# EAGLE design Own_Multi.Display.Board.dev_v1.0_Final_AR (EAGLE 9.6.2)
COMPANY: ADAFRUIT INDUSTRIES; DRAWN: KTOWN; REV: A; YEAR: 2019
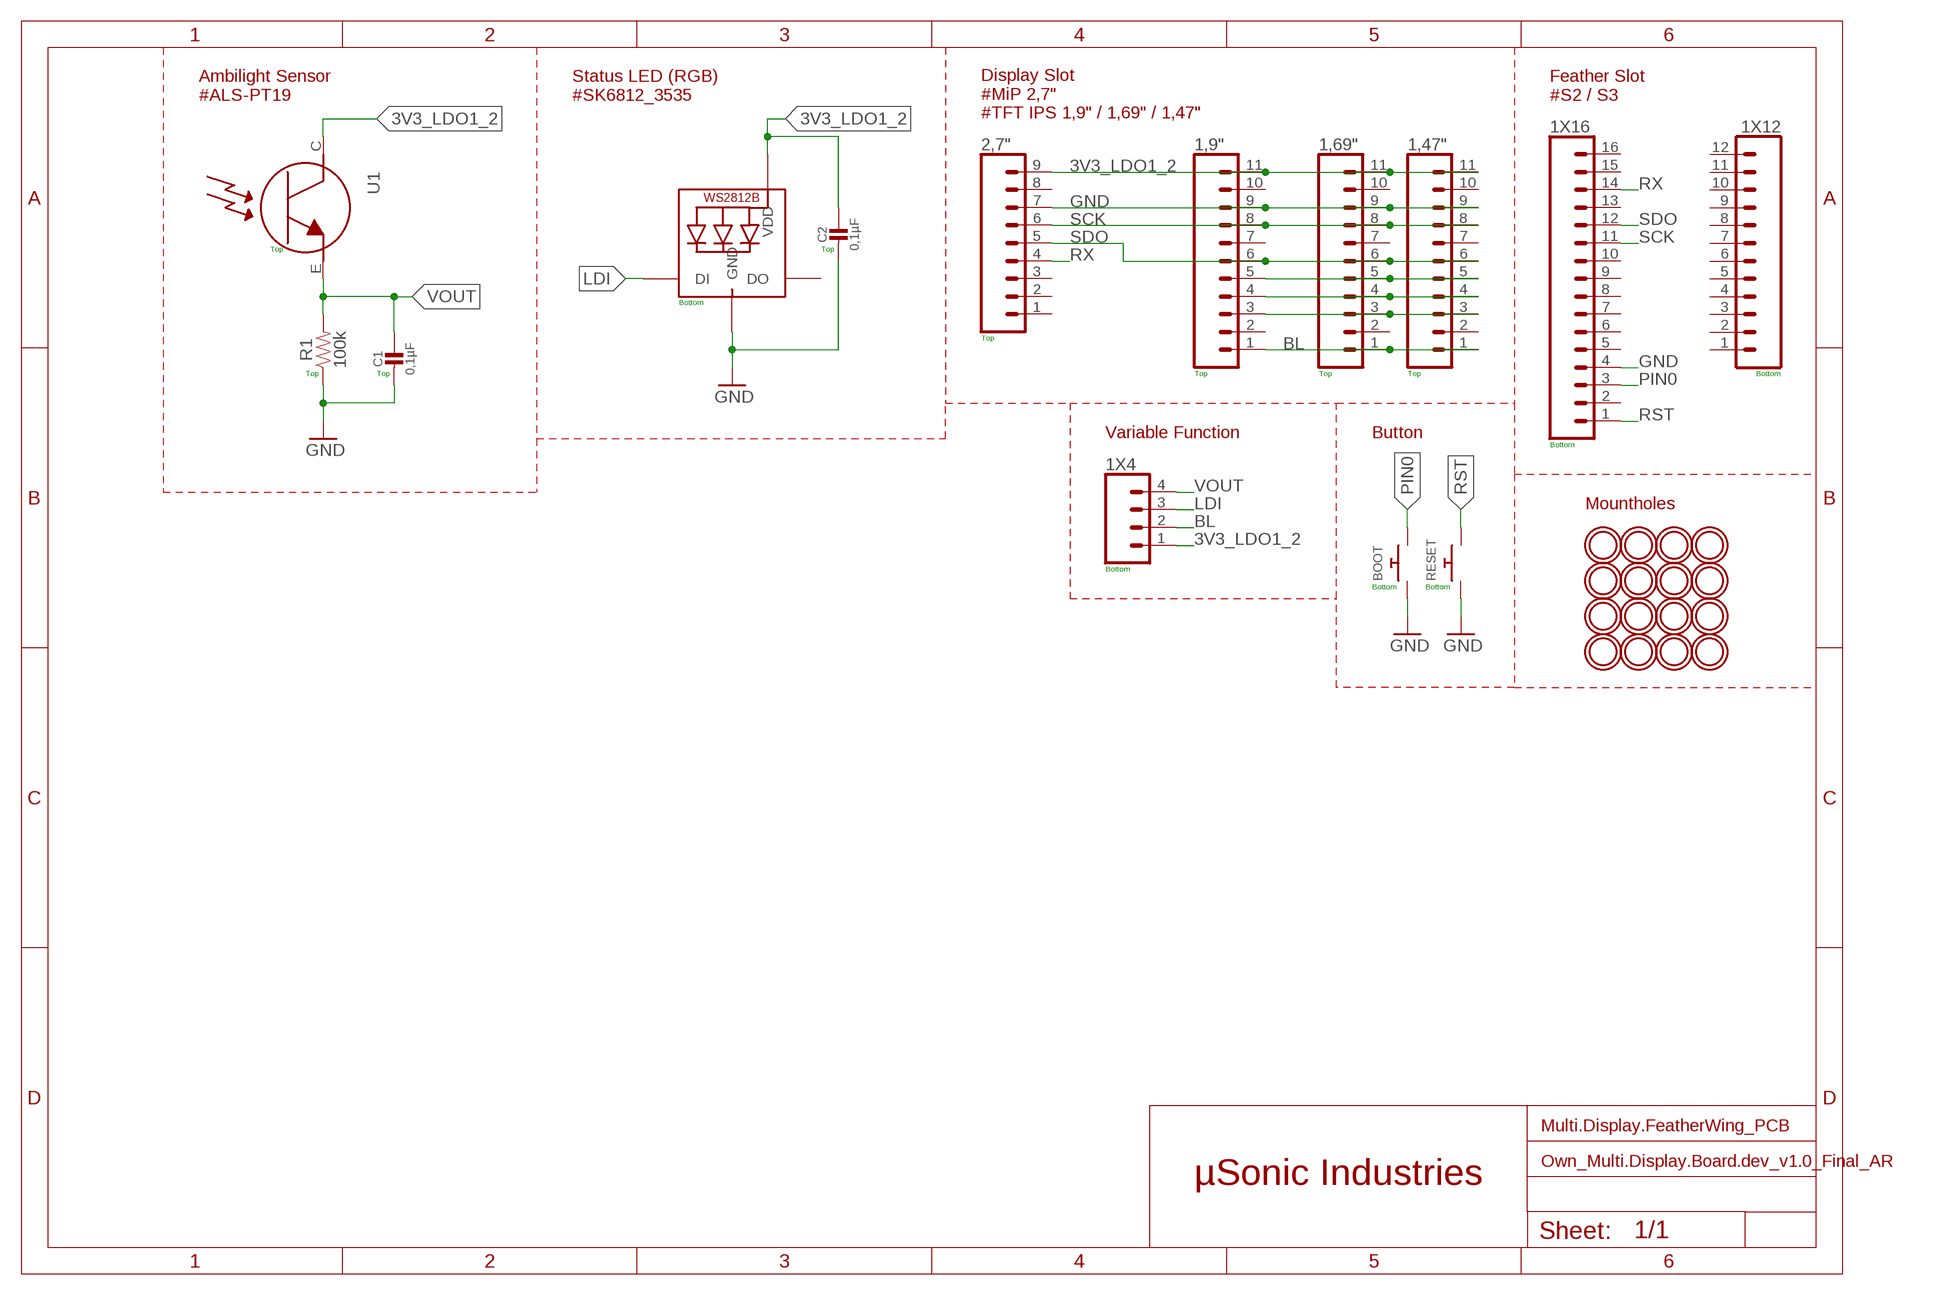
[diagram p0: schematic, sheet 1]

## Parts
1,9"  CONN_111X11_NO_SILK  [1X11_NO_SILK]
1,47"  CONN_111X11_NO_SILK  [1X11_NO_SILK]
1,69"  CONN_111X11_NO_SILK  [1X11_NO_SILK]
1X4  CONN_041X04_NO_SILK  [1X04_NO_SILK]
1X12  CONN_12NO_SILK  [1X12_NO_SILK]
1X16  CONN_161X16_NO_SILK  [1X16_NO_SILK]
2,7"  CONN_09NO_SILK  [1X09_NO_SILK]
BOOT  SWITCH_PUSHBUTTONSF_OWN  [OWN_TACT_PANA-EVQ]
C1  0,1µF  MICROBUILDER_CAP_CERAMIC0805_10MGAP  [MICROBUILDER_0805_10MGAP]
C2  0,1µF  MICROBUILDER_CAP_CERAMIC0805_10MGAP  [MICROBUILDER_0805_10MGAP]
LED1  MICROBUILDER_WS2812B_SK6812E  [MICROBUILDER_NEO3535_REVERSE]
R1  100k  RESISTOR0805  [0805]
RESET  SWITCH_PUSHBUTTONSF_OWN  [OWN_TACT_PANA-EVQ]
U1  MICROBUILDER_LIGHT_ALS-PT19-315C  [MICROBUILDER_ALS-PT19-315C]
U$5  MOUNTINGHOLE2.5  [MOUNTINGHOLE_2.5_PLATED]
U$8  MOUNTINGHOLE2.5  [MOUNTINGHOLE_2.5_PLATED]
U$16  MOUNTINGHOLE2.5  [MOUNTINGHOLE_2.5_PLATED]
U$18  MOUNTINGHOLE2.5  [MOUNTINGHOLE_2.5_PLATED]
U$19  MOUNTINGHOLE2.5  [MOUNTINGHOLE_2.5_PLATED]
U$23  MOUNTINGHOLE2.5  [MOUNTINGHOLE_2.5_PLATED]
U$24  MOUNTINGHOLE2.5  [MOUNTINGHOLE_2.5_PLATED]
U$25  MOUNTINGHOLE2.5  [MOUNTINGHOLE_2.5_PLATED]
U$26  MOUNTINGHOLE2.5  [MOUNTINGHOLE_2.5_PLATED]
U$27  MOUNTINGHOLE2.5  [MOUNTINGHOLE_2.5_PLATED]
U$28  MOUNTINGHOLE2.5  [MOUNTINGHOLE_2.5_PLATED]
U$29  MOUNTINGHOLE2.5  [MOUNTINGHOLE_2.5_PLATED]
U$30  MOUNTINGHOLE2.5  [MOUNTINGHOLE_2.5_PLATED]
U$31  MOUNTINGHOLE2.5  [MOUNTINGHOLE_2.5_PLATED]
U$32  MOUNTINGHOLE2.5  [MOUNTINGHOLE_2.5_PLATED]
U$33  MOUNTINGHOLE2.5  [MOUNTINGHOLE_2.5_PLATED]

## Nets
3V3_LDO1_2: 1,9".11 1,47".11 1,69".11 1X4.1 2,7".9 C2.1 LED1.1-VDD(VDD) U1.C
BL: 1,9".1 1,47".1 1,69".1 1X4.2
GND: 1,9".9 1,47".9 1,69".9 1X16.4 2,7".7 BOOT.P$1 C1.2 C2.2 LED1.3-GND(GND) R1.1 RESET.P$1
LDI: 1X4.3 LED1.4-DIN(DI)
N$7: 1,9".5 1,47".5 1,69".5
N$8: 1,9".4 1,47".4 1,69".4
N$9: 1,9".3 1,47".3 1,69".3
PIN0: 1X16.3 BOOT.P$2
RST: 1X16.1 RESET.P$2
RX: 1X16.14 2,7".4
SCK: 1,9".8 1,47".8 1,69".8 1X16.11 2,7".6
SDO: 1,9".6 1,47".6 1,69".6 1X16.12 2,7".5
VOUT: 1X4.4 C1.1 R1.2 U1.E
Unconnected: 1,9".2 1,9".7 1,9".10 1,47".2 1,47".7 1,47".10 1,69".2 1,69".7 1,69".10 1X12.1 1X12.2 1X12.3 1X12.4 1X12.5 1X12.6 1X12.7 1X12.8 1X12.9 1X12.10 1X12.11 1X12.12 1X16.2 1X16.5 1X16.6 1X16.7 1X16.8 1X16.9 1X16.10 1X16.13 1X16.15 1X16.16 2,7".1 2,7".2 2,7".3 2,7".8 LED1.2-DOUT(DO)

## Notes on the sheet
- Ambilight Sensor
  #ALS-PT19
- Status LED (RGB)
  #SK6812_3535
- Feather Slot
  #S2 / S3
- Display Slot
  #MiP 2,7"
  #TFT IPS 1,9" / 1,69" / 1,47"
- Top | Top
- Bottom
- Top
- Top | Top | Top | Top | Top | Bottom
- Variable Function | Button
- Bottom
- Mountholes
- Bottom
- Bottom | Bottom
- Multi.Display.FeatherWing_PCB
- µSonic Industries

## Library data of the parts
1,9" 1,47" 1,69" = SparkFun-Connectors2:CONN_11: Multi connection point. Often used as Generic Header-pin footprint for 0.1 inch spaced/style header connections On any of the 0.1 inch spaced packages, you can populate with these: Break Away Headers - Straight <https://www.sparkfun.com/products/116> (PRT-00116) Break Away Male Headers - Right Angle <https://www.sparkfun.com/products/553> (PRT-00553) Female Headers <https://www.sparkfun.com/products/115> (PRT-00115) Break Away Headers - Machine Pin <https://www.sparkfun.com/products/117> (PRT-00117) Break Away Female Headers - Swiss Machine Pin <https://www.sparkfun.com/products/743> (PRT-00743) For SCREWTERMINALS and SPRING TERMINALS visit here: Screw Terimnals on SparkFun.com <https://www.sparkfun.com/search/results?term=Screw+Terminals> (5mm/3.5mm/2.54mm spacing) This device is also useful as a general connection point to wire up your design to another part of your project. Our various solder wires solder well into these plated through hole pads. Hook-Up Wire - Assortment (Stranded, 22 AWG) <https://www.sparkfun.com/products/11375> (PRT-11375) Hook-Up Wire - Assortment (Solid Core, 22 AWG) <https://www.sparkfun.com/products/11367> (PRT-11367) View the entire wire category on our website here <https://www.sparkfun.com/categories/141>
1X4 = SparkFun-Connectors2:CONN_04: Multi connection point. Often used as Generic Header-pin footprint for 0.1 inch spaced/style header connections On any of the 0.1 inch spaced packages, you can populate with these: Break Away Headers - Straight <https://www.sparkfun.com/products/116> (PRT-00116) Break Away Male Headers - Right Angle <https://www.sparkfun.com/products/553> (PRT-00553) Female Headers <https://www.sparkfun.com/products/115> (PRT-00115) Break Away Headers - Machine Pin <https://www.sparkfun.com/products/117> (PRT-00117) Break Away Female Headers - Swiss Machine Pin <https://www.sparkfun.com/products/743> (PRT-00743) For SCREWTERMINALS and SPRING TERMINALS visit here: Screw Terimnals on SparkFun.com <https://www.sparkfun.com/search/results?term=Screw+Terminals> (5mm/3.5mm/2.54mm spacing) This device is also useful as a general connection point to wire up your design to another part of your project. Our various solder wires solder well into these plated through hole pads. Hook-Up Wire - Assortment (Stranded, 22 AWG) <https://www.sparkfun.com/products/11375> (PRT-11375) Hook-Up Wire - Assortment (Solid Core, 22 AWG) <https://www.sparkfun.com/products/11367> (PRT-11367) View the entire wire category on our website here <https://www.sparkfun.com/categories/141> Special notes: Molex polarized connector foot print use with SKU : PRT-08231 with associated crimp pins and housings. 1MM SMD Version SKU: PRT-10208; PROD_ID: CONN-09696
1X12 = SparkFun-Connectors2:CONN_12: Multi connection point. Often used as Generic Header-pin footprint for 0.1 inch spaced/style header connections On any of the 0.1 inch spaced packages, you can populate with these: Break Away Headers - Straight <https://www.sparkfun.com/products/116> (PRT-00116) Break Away Male Headers - Right Angle <https://www.sparkfun.com/products/553> (PRT-00553) Female Headers <https://www.sparkfun.com/products/115> (PRT-00115) Break Away Headers - Machine Pin <https://www.sparkfun.com/products/117> (PRT-00117) Break Away Female Headers - Swiss Machine Pin <https://www.sparkfun.com/products/743> (PRT-00743) For SCREWTERMINALS and SPRING TERMINALS visit here: Screw Terimnals on SparkFun.com <https://www.sparkfun.com/search/results?term=Screw+Terminals> (5mm/3.5mm/2.54mm spacing) This device is also useful as a general connection point to wire up your design to another part of your project. Our various solder wires solder well into these plated through hole pads. Hook-Up Wire - Assortment (Stranded, 22 AWG) <https://www.sparkfun.com/products/11375> (PRT-11375) Hook-Up Wire - Assortment (Solid Core, 22 AWG) <https://www.sparkfun.com/products/11367> (PRT-11367) View the entire wire category on our website here <https://www.sparkfun.com/categories/141> Special notes: Molex polarized connector foot print use with SKU : PRT-08231 with associated crimp pins and housings. 1MM SMD Version SKU: PRT-10208 NOTES ON THE VARIANTS LOCK and LOCK_LONGPADS... This footprint was designed to help hold the alignment of a through-hole component (i.e. 6-pin header) while soldering it into place. You may notice that each hole has been shifted either up or down by 0.005 of an inch from it's more standard position (which is a perfectly straight line). This slight alteration caused the pins (the squares in the middle) to touch the edges of the holes. Because they are alternating, it causes a "brace" to hold the component in place. 0.005 has proven to be the perfect amount of "off-center" position when using our standard breakaway headers. Although looks a little odd when you look at the bare footprint, once you have a header in there, the alteration is very hard to notice. Also,if you push a header all the way into place, it is covered up entirely on the bottom side.
1X16 = SparkFun-Connectors2:CONN_16: Multi connection point. Often used as Generic Header-pin footprint for 0.1 inch spaced/style header connections On any of the 0.1 inch spaced packages, you can populate with these: Break Away Headers - Straight <https://www.sparkfun.com/products/116> (PRT-00116) Break Away Male Headers - Right Angle <https://www.sparkfun.com/products/553> (PRT-00553) Female Headers <https://www.sparkfun.com/products/115> (PRT-00115) Break Away Headers - Machine Pin <https://www.sparkfun.com/products/117> (PRT-00117) Break Away Female Headers - Swiss Machine Pin <https://www.sparkfun.com/products/743> (PRT-00743) For SCREWTERMINALS and SPRING TERMINALS visit here: Screw Terimnals on SparkFun.com <https://www.sparkfun.com/search/results?term=Screw+Terminals> (5mm/3.5mm/2.54mm spacing) This device is also useful as a general connection point to wire up your design to another part of your project. Our various solder wires solder well into these plated through hole pads. Hook-Up Wire - Assortment (Stranded, 22 AWG) <https://www.sparkfun.com/products/11375> (PRT-11375) Hook-Up Wire - Assortment (Solid Core, 22 AWG) <https://www.sparkfun.com/products/11367> (PRT-11367) View the entire wire category on our website here <https://www.sparkfun.com/categories/141> Special notes: Molex polarized connector foot print use with SKU : PRT-08231 with associated crimp pins and housings. 1MM SMD Version SKU: PRT-10208 NOTES ON THE VARIANTS LOCK and LOCK_LONGPADS... This footprint was designed to help hold the alignment of a through-hole component (i.e. 6-pin header) while soldering it into place. You may notice that each hole has been shifted either up or down by 0.005 of an inch from it's more standard position (which is a perfectly straight line). This slight alteration caused the pins (the squares in the middle) to touch the edges of the holes. Because they are alternating, it causes a "brace" to hold the component in place. 0.005 has proven to be the perfect amount of "off-center" position when using our standard breakaway headers. Although looks a little odd when you look at the bare footprint, once you have a header in there, the alteration is very hard to notice. Also,if you push a header all the way into place, it is covered up entirely on the bottom side.
2,7" = SparkFun-Connectors2:CONN_09: Multi connection point. Often used as Generic Header-pin footprint for 0.1 inch spaced/style header connections On any of the 0.1 inch spaced packages, you can populate with these: Break Away Headers - Straight <https://www.sparkfun.com/products/116> (PRT-00116) Break Away Male Headers - Right Angle <https://www.sparkfun.com/products/553> (PRT-00553) Female Headers <https://www.sparkfun.com/products/115> (PRT-00115) Break Away Headers - Machine Pin <https://www.sparkfun.com/products/117> (PRT-00117) Break Away Female Headers - Swiss Machine Pin <https://www.sparkfun.com/products/743> (PRT-00743) For SCREWTERMINALS and SPRING TERMINALS visit here: Screw Terimnals on SparkFun.com <https://www.sparkfun.com/search/results?term=Screw+Terminals> (5mm/3.5mm/2.54mm spacing) This device is also useful as a general connection point to wire up your design to another part of your project. Our various solder wires solder well into these plated through hole pads. Hook-Up Wire - Assortment (Stranded, 22 AWG) <https://www.sparkfun.com/products/11375> (PRT-11375) Hook-Up Wire - Assortment (Solid Core, 22 AWG) <https://www.sparkfun.com/products/11367> (PRT-11367) View the entire wire category on our website here <https://www.sparkfun.com/categories/141> Special notes: Molex polarized connector foot print use with SKU : PRT-08231 with associated crimp pins and housings. 1MM SMD Version SKU: PRT-10208 NOTES ON THE VARIANTS LOCK and LOCK_LONGPADS... This footprint was designed to help hold the alignment of a through-hole component (i.e. 6-pin header) while soldering it into place. You may notice that each hole has been shifted either up or down by 0.005 of an inch from it's more standard position (which is a perfectly straight line). This slight alteration caused the pins (the squares in the middle) to touch the edges of the holes. Because they are alternating, it causes a "brace" to hold the component in place. 0.005 has proven to be the perfect amount of "off-center" position when using our standard breakaway headers. Although looks a little odd when you look at the bare footprint, once you have a header in there, the alteration is very hard to notice. Also,if you push a header all the way into place, it is covered up entirely on the bottom side.
BOOT RESET = adafruit2:SWITCH_PUSHBUTTON: Buttons SOFTTOUCHSMD_SJ - Soft touch temporary push button (Super Junk Akihabara) Compatible with SKPMANE010 [Mouser: 688-SKPMAN] C&K_KSS = Digikey: KSS221GLFS
C1 C2 = Adafruit QT2040 Trinkey:MICROBUILDER_CAP_CERAMIC: Ceramic Capacitors For new designs, use the packages preceded by an '_' character since they are more reliable: The following footprints should be used on most boards: _0402 - Standard footprint for regular board layouts _0603 - Standard footprint for regular board layouts _0805 - Standard footprint for regular board layouts _1206 - Standard footprint for regular board layouts For extremely tight-pitch boards where space is at a premium, the following 'micro-pitch' footprints can be used (smaller pads, no silkscreen outline, etc.): _0402MP - Micro-pitch footprint for very dense/compact boards _0603MP - Micro-pitch footprint for very dense/compact boards _0805MP - Micro-pitch footprint for very dense/compact boards _1206MP - Micro-pitch footprint for very dense/compact boards
LED1 = Adafruit QT2040 Trinkey:MICROBUILDER_WS2812B
R1 = SparkFun-Resistors:RESISTOR: Generic Resistor Package
U1 = Adafruit ALS-PT19-315C Breakout:MICROBUILDER_LIGHT_ALS-PT19-315C: ALS-PT19-315C - Analog Light Sensor VCC: 2.5-5.5V
U$5 U$8 U$16 U$18 U$19 U$23-U$33 = microbuilder:MOUNTINGHOLE: Mounting Hole For #2 screws (0.086"/2.18mm width, 0.094"/2.4mm hole) use 2.5mm; BOM: EXCLUDE

## Net classes
0 default: width 0.175 mm

## Board
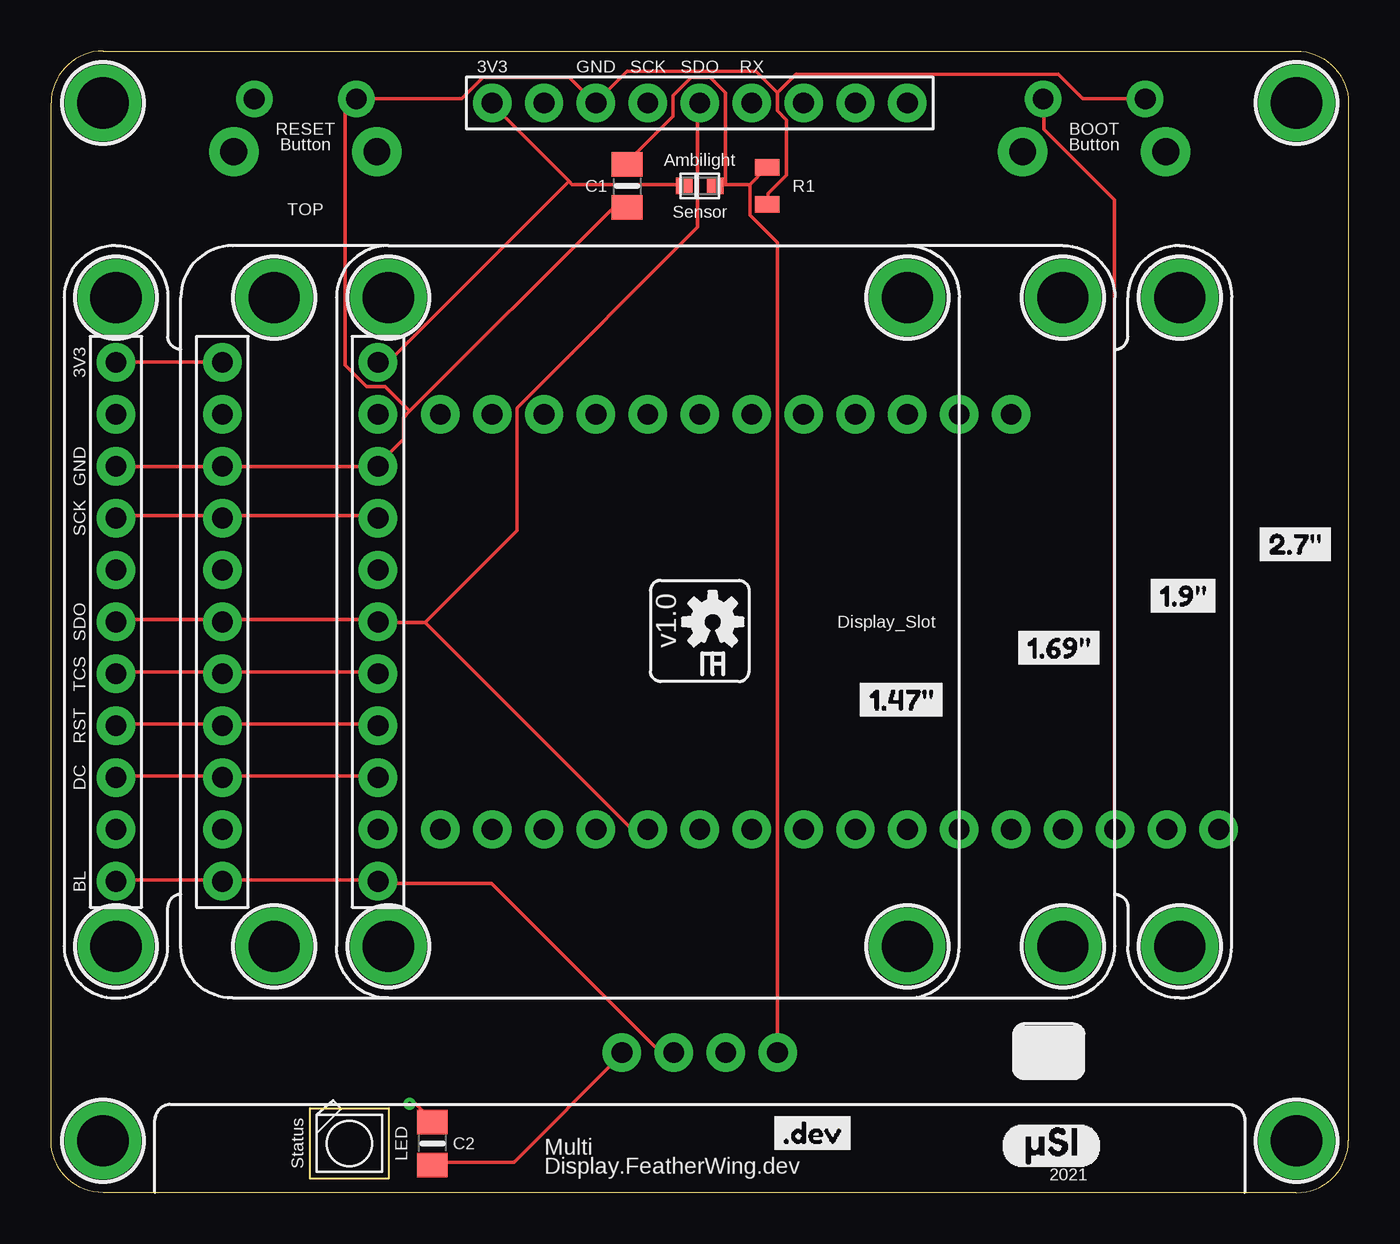
[diagram p1: board, top side]
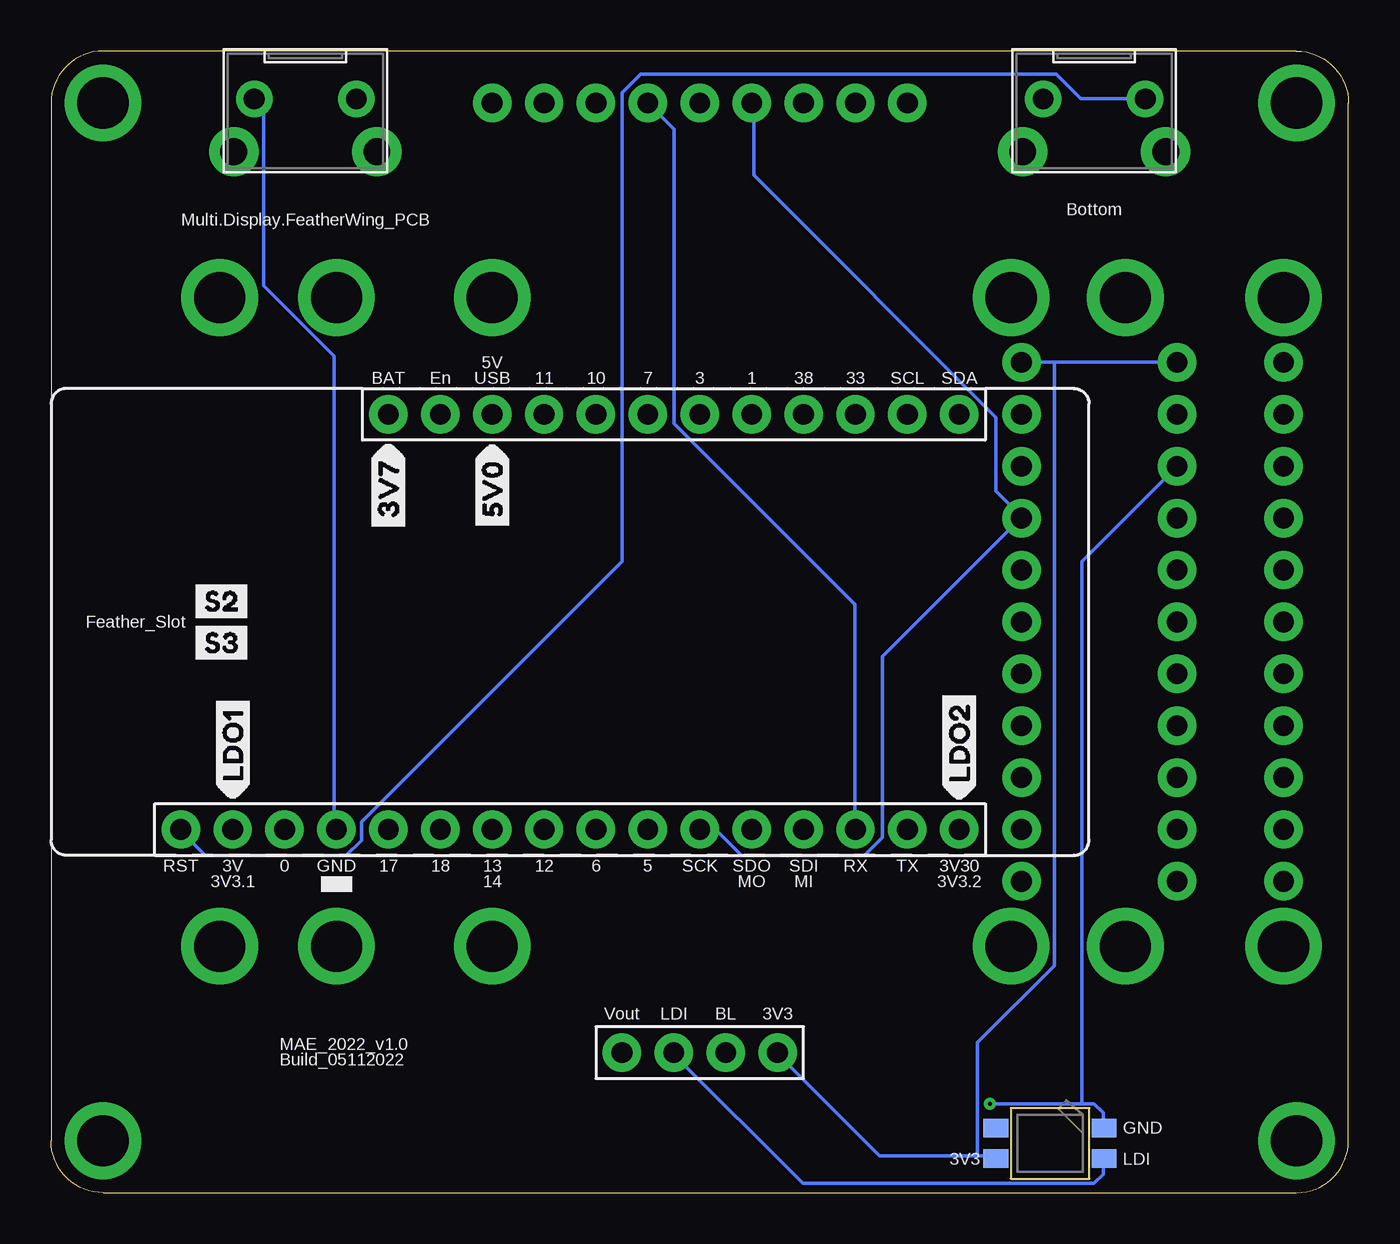
[diagram p2: board, bottom side, seen from below]

Size 63.5 x 55.88 mm. Coordinates in mm from the lower left corner, seen from the top.
Outline: 0,2.54 0,53.34 arc-90 2.54,55.88 60.96,55.88 arc-90 63.5,53.34 63.5,2.54 arc-90 60.96,0 2.54,0 arc-90 0,2.54
Copper layers (1*16): Top 0.035mm / dielectric 1.5mm / Bottom 0.035mm
Design rules "aisler_2_layer_complex": minimum track width 0.125mm, minimum drill 0.2mm, track to track 0.125mm, track to pad 0.125mm, pad to pad 0.125mm, via to via 0.125mm, smd to smd 0.125mm, copper to edge 0.3mm, drill to drill 0.25mm, minimum pad ring 0.2mm, minimum via ring 0.2mm, stop-mask expansion 0mil, vias tented up to drill 0mil, thermal gap 10mil

### Footprints (pad centres in the part's own frame; a part is rotated, then mirrored left to right if it is on the bottom)
1X11_NO_SILK = drill 1.016 pad 1.88: 1 0,0; 2 2.54,0; 3 5.08,0; 4 7.62,0; 5 10.16,0; 6 12.7,0; 7 15.24,0; 8 17.78,0; 9 20.32,0; 10 22.86,0; 11 25.4,0
1X04_NO_SILK = drill 1.016 pad 1.88: 1 0,0; 2 2.54,0; 3 5.08,0; 4 7.62,0
1X12_NO_SILK = drill 1.016 pad 1.88: 1 0,0; 2 2.54,0; 3 5.08,0; 4 7.62,0; 5 10.16,0; 6 12.7,0; 7 15.24,0; 8 17.78,0; 9 20.32,0; 10 22.86,0; 11 25.4,0; 12 27.94,0
1X16_NO_SILK = drill 1.016 pad 1.88: 1 0,0; 2 2.54,0; 3 5.08,0; 4 7.62,0; 5 10.16,0; 6 12.7,0; 7 15.24,0; 8 17.78,0; 9 20.32,0; 10 22.86,0; 11 25.4,0; 12 27.94,0; 13 30.48,0; 14 33.02,0; 15 35.56,0; 16 38.1,0
1X09_NO_SILK = drill 1.016 pad 1.88: 1 0,0; 2 2.54,0; 3 5.08,0; 4 7.62,0; 5 10.16,0; 6 12.7,0; 7 15.24,0; 8 17.78,0; 9 20.32,0
OWN_TACT_PANA-EVQ = drill 1.016 pad 1.778: P$1 -2.5,0.58; P$2 2.5,0.58 | drill 1.321 pad 2.413: P$3 -3.5,-2; P$4 3.5,-2
MICROBUILDER_0805_10MGAP = smd 1.2 x 1.5: 1 -1.05,0; 2 1.05,0
MICROBUILDER_NEO3535_REVERSE = smd 1.2 x 0.9 bottom: 1-VDD 2.65,-0.75; 2-DOUT 2.65,0.75; 3-GND -2.65,0.75; 4-DIN -2.65,-0.75
0805 = smd 0.8 x 1.2: 1 -0.9,0; 2 0.9,0
MICROBUILDER_ALS-PT19-315C = smd 0.8 x 0.8: C -0.75,0; E 0.75,0
MOUNTINGHOLE_2.5_PLATED = drill 2.5 pad 3.2: P$1 0,0

### Placement (x,y rotation side)
1,9"  3.17,15.24 90 top
1,47"  16,15.24 90 top
1,69"  8.38,15.24 90 top
1X4  27.94,6.86 0 top
1X12  46.99,38.1 180 top
1X16  57.15,17.78 180 top
2,7"  41.91,53.34 180 top
BOOT  51.05,52.96 0 bottom
C1  28.19,49.28 270 top
C2  18.67,2.41 90 top
LED1  14.61,2.41 0 top
R1  35.05,49.28 90 top
RESET  12.45,52.96 0 bottom
U1  31.75,49.28 0 top
U$1  [LDO15]  54.61,19.18 90 bottom
U$4  [OSHW-LOGO-S]  32.38,27.94 0 top
U$5  2.54,2.54 0 top
U$6  [#DEV15]  34.92,2.92 0 top
U$7  [LDO26]  19.05,19.18 90 bottom
U$8  55.24,43.81 0 top
U$9  [3V72]  46.99,32.13 90 bottom
U$10  [5V03]  41.91,32.13 90 bottom
U$15  [S212]  56.9,28.96 0 bottom
U$16  55.24,12.06 0 top
U$17  [S313]  56.9,26.92 0 bottom
U$18  3.17,43.81 0 top
U$19  3.17,12.06 0 top
U$22  [#SI0]  46.48,2.29 0 top
U$23  60.96,53.34 0 top
U$24  2.54,53.34 0 top
U$25  60.96,2.54 0 top
U$26  10.92,43.81 0 top
U$27  49.53,12.06 0 top
U$28  49.53,43.81 0 top
U$29  10.92,12.06 0 top
U$30  41.91,43.81 0 top
U$31  16.51,43.81 0 top
U$32  16.51,12.06 0 top
U$33  41.91,12.06 0 top
U$34  [1#9#11]  53.34,29.21 0 top
U$35  [1#69#10]  46.86,26.67 0 top
U$36  [1#47#9]  39.12,24.13 0 top
U$37  [2#7#12]  58.67,31.75 0 top

### Tracks (layer width: path | path; a pad name or v marks a point on that pad's centre or on a via)
3V3_LDO1_2
  Top 0.175: C2.1 18.75,1.5 22.65,1.5 27.9,6.75 1X4.1 | 25.35,49.5 21.6,53.25 2,7".9 | 25.35,49.5 25.5,49.35 30.9,49.35 U1.C | 1,9".11 3.3,40.65 8.25,40.65 1,69".11 | 25.35,49.5 16.5,40.65 16.05,40.65 1,47".11
  Bottom 0.175: 18.15,1.8 22.95,1.8 27.9,6.75 1X4.1 | 18.15,1.8 17.4,1.8 LED1.1-VDD | 14.4,40.65 8.4,40.65 1,69".11 | 14.4,40.65 15.9,40.65 1,47".11 | 18.15,1.8 18.15,7.35 14.4,11.1 14.4,40.65
BL
  Top 0.175: 1,9".1 3.3,15.3 8.25,15.3 1,69".1 8.4,15.3 15.9,15.3 1,47".1 16.05,15.15 21.55,15.15 29.8,6.9 30.45,6.9 1X4.2
GND  (via drill 0.2)
  Top 0.175: 17.55,38.25 17.25,37.95 17.25,36.9 16.05,35.7 1,47".9 15.9,35.55 8.4,35.55 1,69".9 8.25,35.55 3.3,35.55 1,9".9 | 17.55,38.25 27.45,48.15 28.05,48.15 C1.2 | v17.55,4.35 17.85,4.35 18.6,3.6 C2.2 | 35.55,53.85 35.55,52.95 36,52.5 36,49.8 35.1,48.9 35.1,48.45 R1.1 | 35.55,53.85 34.5,54.9 28.2,54.9 26.7,53.4 2,7".7 26.55,53.4 25.35,54.6 21.15,54.6 20.1,53.55 15,53.55 RESET.P$1 14.85,53.4 14.4,52.95 14.4,40.5 15.45,39.45 16.35,39.45 17.55,38.25 | 35.55,53.85 36.45,54.75 49.3,54.75 50.5,53.55 BOOT.P$1
  Bottom 0.175: v17.55,4.35 13.05,4.35 | 13.05,4.35 12.45,4.35 12,3.9 12,3.3 LED1.3-GND | 13.05,4.35 13.05,30.9 8.4,35.55 1,69".9 | 1X16.4 49.65,17.85 49.65,40.95 53.1,44.4 53.1,52.95 53.55,53.4 BOOT.P$1
LDI
  Bottom 0.175: LED1.4-DIN 12,1.65 12,0.9 12.45,0.45 26.7,0.45 33,6.75 1X4.3
N$7
  Top 0.175: 1,9".5 3.3,25.5 8.25,25.5 1,69".5 8.4,25.5 15.9,25.5 1,47".5
N$8
  Top 0.175: 1,9".4 3.3,22.95 8.25,22.95 1,69".4 8.4,22.95 15.9,22.95 1,47".4
N$9
  Top 0.175: 1,9".3 3.3,20.4 8.25,20.4 1,69".3 8.4,20.4 15.9,20.4 1,47".3
PIN0
  Top 0.175: BOOT.P$2 48.6,53.4 48.6,52.05 52.05,48.6 52.05,17.85 1X16.3
RST
  Bottom 0.175: RESET.P$2 10.05,53.55 13.1,53.55 14.3,54.75 34.65,54.75 35.55,53.85 35.55,30.9 48.3,18.15 48.3,17.25 49.05,16.5 55.95,16.5 57.15,17.7 1X16.1
RX
  Bottom 0.175: 2,7".4 33,52.05 33,37.65 24.15,28.8 24.15,17.85 1X16.14
SCK
  Top 0.175: 1,9".8 3.3,33.15 8.25,33.15 1,69".8 8.4,33.15 15.9,33.15 1,47".8
  Bottom 0.175: 1X16.11 31.65,17.7 30.9,17.7 29.7,16.5 23.7,16.5 22.8,17.4 22.8,26.25 16.05,33 1,47".8 16.05,33.15 17.25,34.35 17.25,37.95 29.1,49.8 29.1,53.25 2,7".6
SDO
  Top 0.175: 1,9".6 3.3,28.05 8.25,28.05 1,69".6 8.4,28.05 15.9,28.05 1,47".6 16.05,27.9 18.3,27.9 | 18.3,27.9 28.35,17.85 29.1,17.85 1X16.12 | 18.3,27.9 22.8,32.4 22.8,38.4 31.65,47.25 31.65,53.25 2,7".5
VOUT
  Top 0.175: 34.2,49.35 33,49.35 | 33,49.35 32.55,49.35 U1.E | 34.2,49.35 34.95,50.1 R1.2 | 33,49.35 33,53.85 32.25,54.6 31.35,54.6 30.45,53.7 30.45,52.7 28.2,50.45 28.2,50.4 C1.1 | 34.2,49.35 34.2,47.85 35.55,46.5 35.55,6.9 1X4.4

### Text on the board
tPlace: 3V3 | GND | SCK | SDO | RX | RESET | BOOT | Button | Ambilight | Button | C1 | R1 | TOP | Sensor | 3V3 | GND | SCK | SDO | Display_Slot | v1.0 | TCS | RST | DC | BL | Status | LED | C2 | Multi / Display.FeatherWing.dev | 2021
bPlace: Bottom | Multi.Display.FeatherWing_PCB | 5V | SDA | SCL | 33 | 38 | 1 | 3 | 7 | 10 | 11 | USB | En | BAT | Feather_Slot | 3V30 | TX | RX | SDI | SDO | SCK | 5 | 6 | 12 | 13 | 18 | 17 | GND | 0 | 3V | RST | 3V3.2 | MI | MO | 14 | 3V3.1 | 3V3 | BL | LDI | Vout | MAE_2022_v1.0 / Build_05112022 | GND | LDI | 3V3
tStop: µSI | 2021 | Test
Hilfe: RESET | BOOT